# Altium schematic sheet P7_CCD_CAM_BOARD_MYIR.SchDoc
size A3
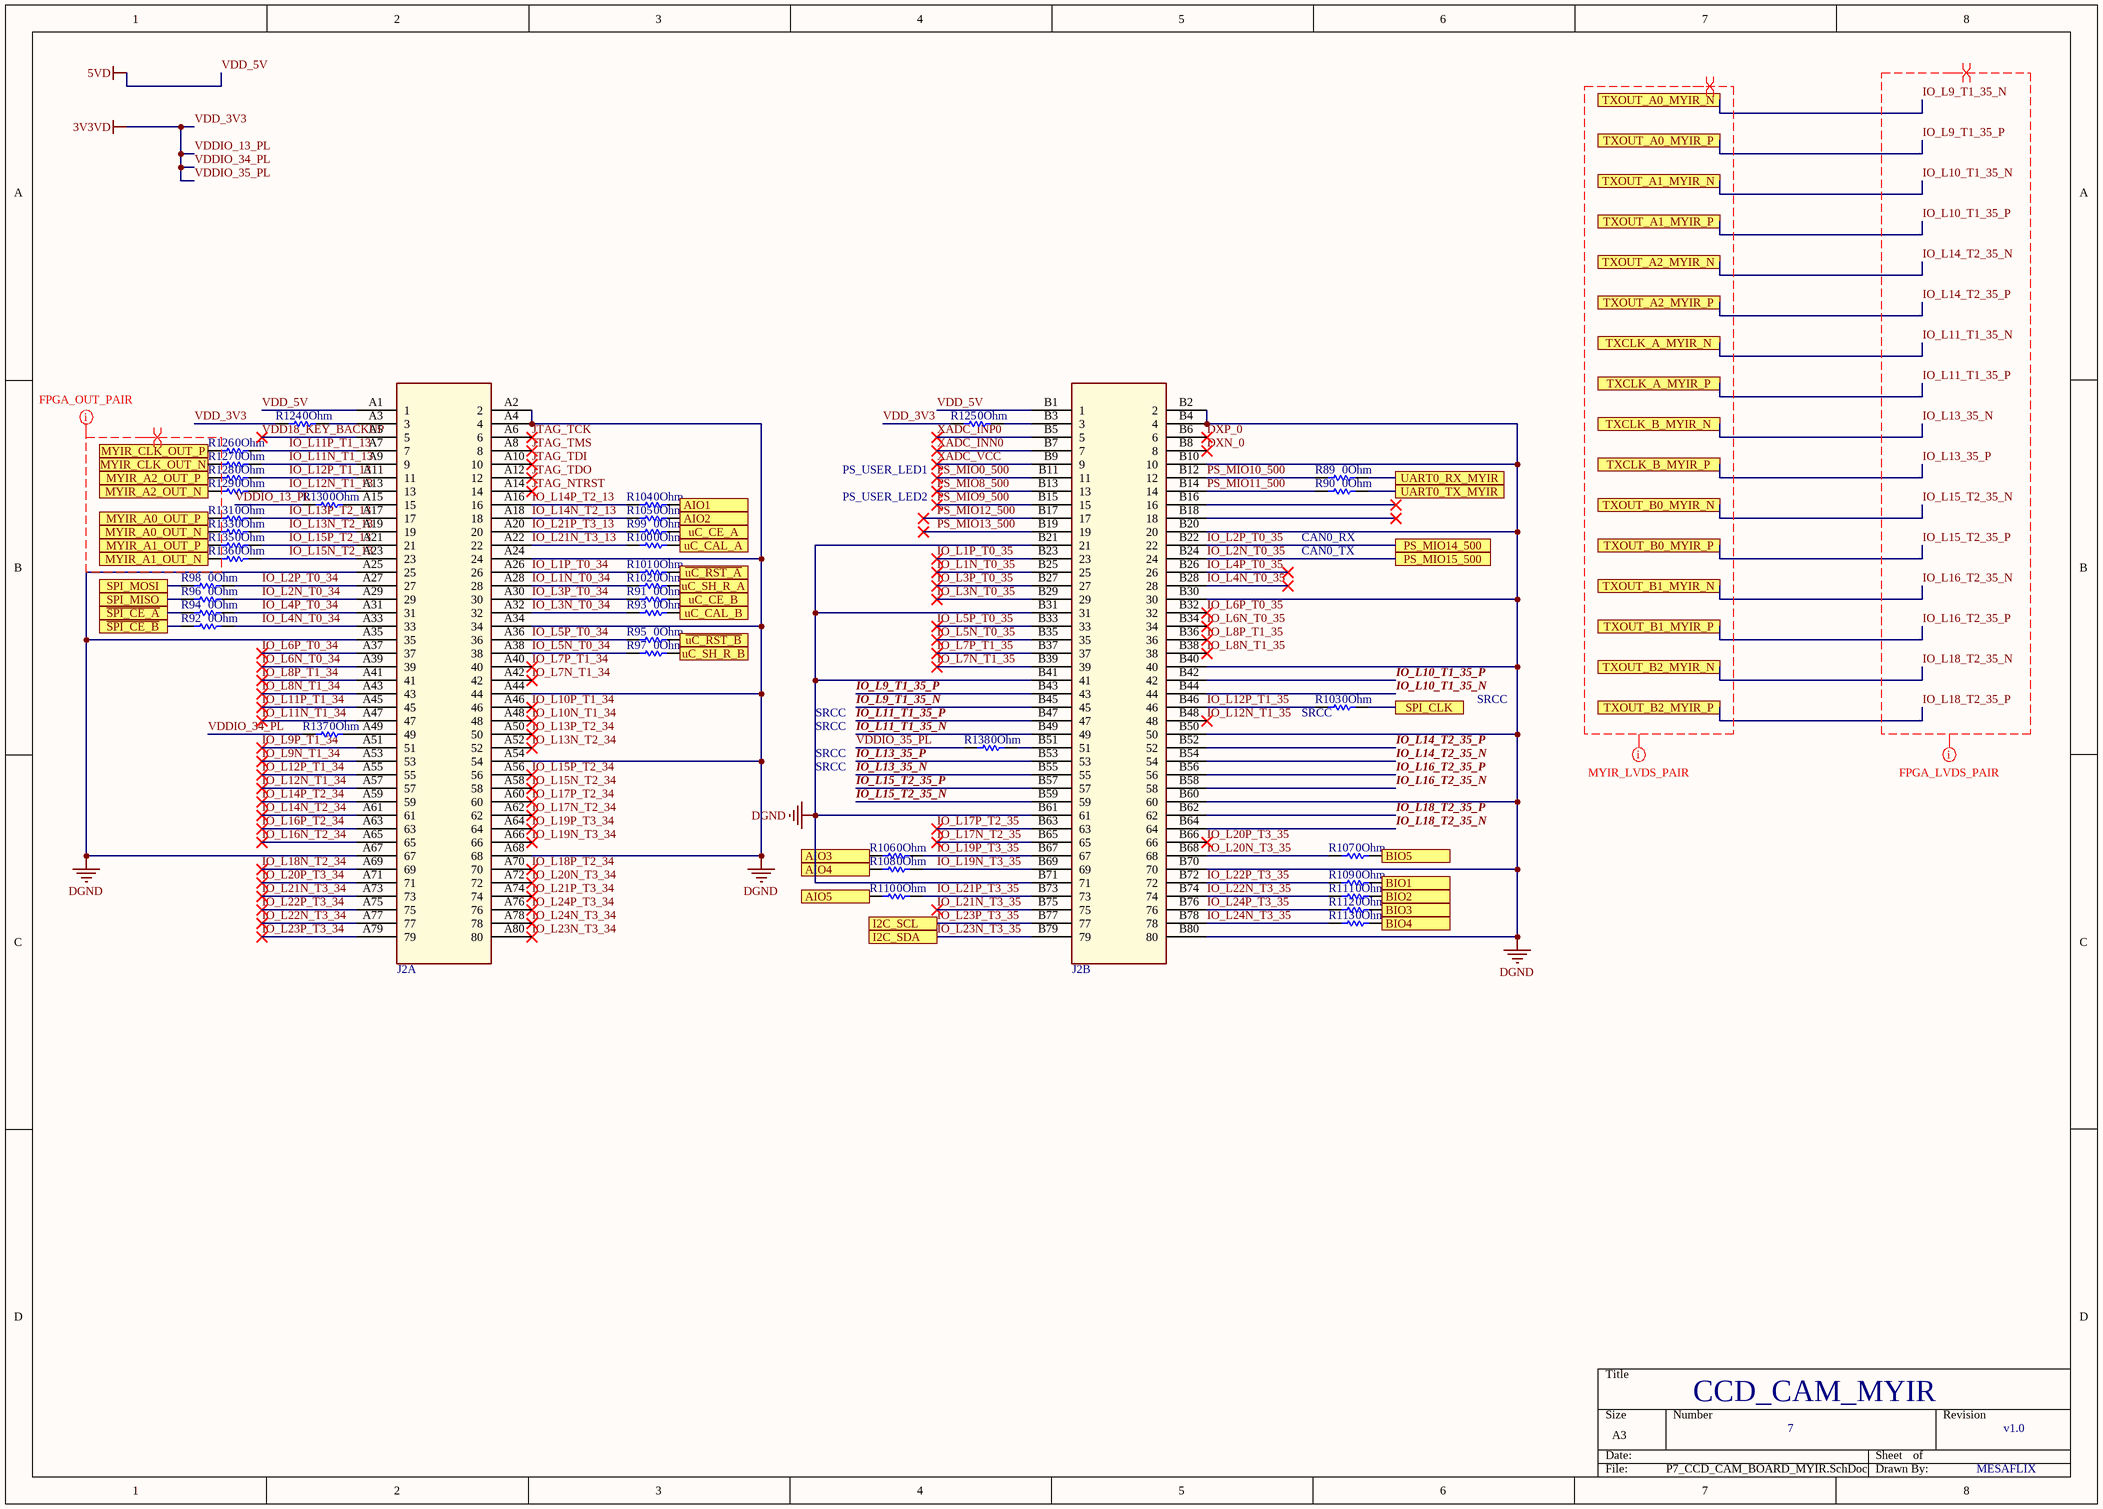
[diagram p0: P7_CCD_CAM_BOARD_MYIR.SchDoc]

## Parts
J2  40x2 Connector 1.27mm Pitch  [CON2x80_MYIR_SMD]  (value not drawn)  (parts A,B of 2)
R89  value 0Ohm  [R 0402(1005)]  (hidden comment: RES_DNP_0603)
R90  value 0Ohm  [R 0402(1005)]  (hidden comment: RES_DNP_0603)
R91  value 0Ohm  [R 0402(1005)]  (hidden comment: RES_DNP_0603)
R92  value 0Ohm  [R 0402(1005)]  (hidden comment: RES_DNP_0603)
R93  value 0Ohm  [R 0402(1005)]  (hidden comment: RES_DNP_0603)
R94  value 0Ohm  [R 0402(1005)]  (hidden comment: RES_DNP_0603)
R95  value 0Ohm  [R 0402(1005)]  (hidden comment: RES_DNP_0603)
R96  value 0Ohm  [R 0402(1005)]  (hidden comment: RES_DNP_0603)
R97  value 0Ohm  [R 0402(1005)]  (hidden comment: RES_DNP_0603)
R98  value 0Ohm  [R 0402(1005)]  (hidden comment: RES_DNP_0603)
R99  value 0Ohm  [R 0402(1005)]  (hidden comment: RES_DNP_0603)
R100  value 0Ohm  [R 0402(1005)]  (hidden comment: RES_DNP_0603)
R101  value 0Ohm  [R 0402(1005)]  (hidden comment: RES_DNP_0603)
R102  value 0Ohm  [R 0402(1005)]  (hidden comment: RES_DNP_0603)
R103  value 0Ohm  [R 0402(1005)]  (hidden comment: RES_DNP_0603)
R104  value 0Ohm  [R 0402(1005)]  (hidden comment: RES_DNP_0603)
R105  value 0Ohm  [R 0402(1005)]  (hidden comment: RES_DNP_0603)
R106  value 0Ohm  [R 0402(1005)]  (hidden comment: RES_DNP_0603)
R107  value 0Ohm  [R 0402(1005)]  (hidden comment: RES_DNP_0603)
R108  value 0Ohm  [R 0402(1005)]  (hidden comment: RES_DNP_0603)
R109  value 0Ohm  [R 0402(1005)]  (hidden comment: RES_DNP_0603)
R110  value 0Ohm  [R 0402(1005)]  (hidden comment: RES_DNP_0603)
R111  value 0Ohm  [R 0402(1005)]  (hidden comment: RES_DNP_0603)
R112  value 0Ohm  [R 0402(1005)]  (hidden comment: RES_DNP_0603)
R113  value 0Ohm  [R 0402(1005)]  (hidden comment: RES_DNP_0603)
R124  value 0Ohm  [R 0402(1005)]  (hidden comment: RES_DNP_0603)
R125  value 0Ohm  [R 0402(1005)]  (hidden comment: RES_DNP_0603)
R126  value 0Ohm  [R 0402(1005)]  (hidden comment: RES_DNP_0603)
R127  value 0Ohm  [R 0402(1005)]  (hidden comment: RES_DNP_0603)
R128  value 0Ohm  [R 0402(1005)]  (hidden comment: RES_DNP_0603)
R129  value 0Ohm  [R 0402(1005)]  (hidden comment: RES_DNP_0603)
R130  value 0Ohm  [R 0402(1005)]  (hidden comment: RES_DNP_0603)
R131  value 0Ohm  [R 0402(1005)]  (hidden comment: RES_DNP_0603)
R133  value 0Ohm  [R 0402(1005)]  (hidden comment: RES_DNP_0603)
R135  value 0Ohm  [R 0402(1005)]  (hidden comment: RES_DNP_0603)
R136  value 0Ohm  [R 0402(1005)]  (hidden comment: RES_DNP_0603)
R137  value 0Ohm  [R 0402(1005)]  (hidden comment: RES_DNP_0603)
R138  value 0Ohm  [R 0402(1005)]  (hidden comment: RES_DNP_0603)

## Ports
AIO1, AIO2, AIO3, AIO4, AIO5, BIO1, BIO2, BIO3, BIO4, BIO5, I2C_SCL, I2C_SDA, MYIR_A0_OUT_N, MYIR_A0_OUT_P, MYIR_A1_OUT_N, MYIR_A1_OUT_P, MYIR_A2_OUT_N, MYIR_A2_OUT_P, MYIR_CLK_OUT_N, MYIR_CLK_OUT_P, PS_MIO14_500, PS_MIO15_500, SPI_CLK, SPI_MISO, SPI_MOSI, TXCLK_A_MYIR_N, TXCLK_A_MYIR_P, TXCLK_B_MYIR_N, TXCLK_B_MYIR_P, TXOUT_A0_MYIR_N, TXOUT_A0_MYIR_P, TXOUT_A1_MYIR_N, TXOUT_A1_MYIR_P, TXOUT_A2_MYIR_N, TXOUT_A2_MYIR_P, TXOUT_B0_MYIR_N, TXOUT_B0_MYIR_P, TXOUT_B1_MYIR_N, TXOUT_B1_MYIR_P, TXOUT_B2_MYIR_N, TXOUT_B2_MYIR_P, UART0_RX_MYIR, UART0_TX_MYIR, uC_CAL_A, uC_CAL_B, uC_CE_A, uC_CE_B, uC_SH_R_A, uC_SH_R_B, ~{SPI_CE_A}, ~{SPI_CE_B}, ~{uC_RST_A}, ~{uC_RST_B}

## Nets
DGND: J2.A2(2) J2.A4(4) J2.A24(24) J2.A25(25) J2.A34(34) J2.A35(35) J2.A44(44) J2.A54(54) J2.A67(67) J2.A68(68) J2.B2(2) J2.B4(4) J2.B10(10) J2.B20(20) J2.B21(21) J2.B30(30) J2.B31(31) J2.B40(40) J2.B41(41) J2.B50(50) J2.B60(60) J2.B61(61) J2.B70(70) J2.B71(71) J2.B80(80)
VDD_3V3: R124.1 R125.1 R130.1 R137.1 R138.1  [also labelled 3V3VD, VDDIO_13_PL, VDDIO_34_PL, VDDIO_35_PL]
VDD_5V: J2.A1(1) J2.B1(1)  [also labelled 5VD]
AIO1: R104.2 ; port AIO1
AIO2: R105.2 ; port AIO2
AIO3: R106.1 ; port AIO3
AIO4: R108.1 ; port AIO4
AIO5: R110.1 ; port AIO5
BIO1: R109.2 ; port BIO1
BIO2: R111.2 ; port BIO2
BIO3: R112.2 ; port BIO3
BIO4: R113.2 ; port BIO4
BIO5: R107.2 ; port BIO5
DXN_0: J2.B8(8)
DXP_0: J2.B6(6)
IO_L1N_T0_34: J2.A28(28) R102.1
IO_L1N_T0_35: J2.B25(25)
IO_L1P_T0_34: J2.A26(26) R101.1
IO_L1P_T0_35: J2.B23(23)
IO_L2N_T0_34: J2.A29(29) R96.2
IO_L2N_T0_35: J2.B24(24) ; port PS_MIO15_500
IO_L2P_T0_34: J2.A27(27) R98.2
IO_L2P_T0_35: J2.B22(22) ; port PS_MIO14_500
IO_L3N_T0_34: J2.A32(32) R93.1
IO_L3N_T0_35: J2.B29(29)
IO_L3P_T0_34: J2.A30(30) R91.1
IO_L3P_T0_35: J2.B27(27)
IO_L4N_T0_34: J2.A33(33) R92.2
IO_L4N_T0_35: J2.B28(28)
IO_L4P_T0_34: J2.A31(31) R94.2
IO_L4P_T0_35: J2.B26(26)
IO_L5N_T0_34: J2.A38(38) R97.1
IO_L5N_T0_35: J2.B35(35)
IO_L5P_T0_34: J2.A36(36) R95.1
IO_L5P_T0_35: J2.B33(33)
IO_L6N_T0_34: J2.A39(39)
IO_L6N_T0_35: J2.B34(34)
IO_L6P_T0_34: J2.A37(37)
IO_L6P_T0_35: J2.B32(32)
IO_L7N_T1_34: J2.A42(42)
IO_L7N_T1_35: J2.B39(39)
IO_L7P_T1_34: J2.A40(40)
IO_L7P_T1_35: J2.B37(37)
IO_L8N_T1_34: J2.A43(43)
IO_L8N_T1_35: J2.B38(38)
IO_L8P_T1_34: J2.A41(41)
IO_L8P_T1_35: J2.B36(36)
IO_L9_T1_35_N: J2.B45(45) ; port TXOUT_A0_MYIR_N
IO_L9_T1_35_P: J2.B43(43) ; port TXOUT_A0_MYIR_P
IO_L9N_T1_34: J2.A53(53)
IO_L9P_T1_34: J2.A51(51)
IO_L10_T1_35_N: J2.B44(44) ; port TXOUT_A1_MYIR_N
IO_L10_T1_35_P: J2.B42(42) ; port TXOUT_A1_MYIR_P
IO_L10N_T1_34: J2.A48(48)
IO_L10P_T1_34: J2.A46(46)
IO_L11_T1_35_N: J2.B49(49) ; port TXCLK_A_MYIR_N
IO_L11_T1_35_P: J2.B47(47) ; port TXCLK_A_MYIR_P
IO_L11N_T1_13: J2.A9(9) R127.2
IO_L11N_T1_34: J2.A47(47)
IO_L11P_T1_13: J2.A7(7) R126.2
IO_L11P_T1_34: J2.A45(45)
IO_L12N_T1_13: J2.A13(13) R129.2
IO_L12N_T1_34: J2.A57(57)
IO_L12N_T1_35: J2.B48(48)
IO_L12P_T1_13: J2.A11(11) R128.2
IO_L12P_T1_34: J2.A55(55)
IO_L12P_T1_35: J2.B46(46) R103.1
IO_L13_35_N: J2.B55(55) ; port TXCLK_B_MYIR_N
IO_L13_35_P: J2.B53(53) ; port TXCLK_B_MYIR_P
IO_L13N_T2_13: J2.A19(19) R133.2
IO_L13N_T2_34: J2.A52(52)
IO_L13P_T2_13: J2.A17(17) R131.2
IO_L13P_T2_34: J2.A50(50)
IO_L14_T2_35_N: J2.B54(54) ; port TXOUT_A2_MYIR_N
IO_L14_T2_35_P: J2.B52(52) ; port TXOUT_A2_MYIR_P
IO_L14N_T2_13: J2.A18(18) R105.1
IO_L14N_T2_34: J2.A61(61)
IO_L14P_T2_13: J2.A16(16) R104.1
IO_L14P_T2_34: J2.A59(59)
IO_L15_T2_35_N: J2.B59(59) ; port TXOUT_B0_MYIR_N
IO_L15_T2_35_P: J2.B57(57) ; port TXOUT_B0_MYIR_P
IO_L15N_T2_13: J2.A23(23) R136.2
IO_L15N_T2_34: J2.A58(58)
IO_L15P_T2_13: J2.A21(21) R135.2
IO_L15P_T2_34: J2.A56(56)
IO_L16_T2_35_N: J2.B58(58) ; port TXOUT_B1_MYIR_N
IO_L16_T2_35_P: J2.B56(56) ; port TXOUT_B1_MYIR_P
IO_L16N_T2_34: J2.A65(65)
IO_L16P_T2_34: J2.A63(63)
IO_L17N_T2_34: J2.A62(62)
IO_L17N_T2_35: J2.B65(65)
IO_L17P_T2_34: J2.A60(60)
IO_L17P_T2_35: J2.B63(63)
IO_L18_T2_35_N: J2.B64(64) ; port TXOUT_B2_MYIR_N
IO_L18_T2_35_P: J2.B62(62) ; port TXOUT_B2_MYIR_P
IO_L18N_T2_34: J2.A69(69)
IO_L18P_T2_34: J2.A70(70)
IO_L19N_T3_34: J2.A66(66)
IO_L19N_T3_35: J2.B69(69) R108.2
IO_L19P_T3_34: J2.A64(64)
IO_L19P_T3_35: J2.B67(67) R106.2
IO_L20N_T3_34: J2.A72(72)
IO_L20N_T3_35: J2.B68(68) R107.1
IO_L20P_T3_34: J2.A71(71)
IO_L20P_T3_35: J2.B66(66)
IO_L21N_T3_13: J2.A22(22) R100.1
IO_L21N_T3_34: J2.A73(73)
IO_L21N_T3_35: J2.B75(75)
IO_L21P_T3_13: J2.A20(20) R99.1
IO_L21P_T3_34: J2.A74(74)
IO_L21P_T3_35: J2.B73(73) R110.2
IO_L22N_T3_34: J2.A77(77)
IO_L22N_T3_35: J2.B74(74) R111.1
IO_L22P_T3_34: J2.A75(75)
IO_L22P_T3_35: J2.B72(72) R109.1
IO_L23N_T3_34: J2.A80(80)
IO_L23N_T3_35: J2.B79(79) ; port I2C_SDA
IO_L23P_T3_34: J2.A79(79)
IO_L23P_T3_35: J2.B77(77) ; port I2C_SCL
IO_L24N_T3_34: J2.A78(78)
IO_L24N_T3_35: J2.B78(78) R113.1
IO_L24P_T3_34: J2.A76(76)
IO_L24P_T3_35: J2.B76(76) R112.1
JTAG_NTRST: J2.A14(14)
JTAG_TCK: J2.A6(6)
JTAG_TDI: J2.A10(10)
JTAG_TDO: J2.A12(12)
JTAG_TMS: J2.A8(8)
MYIR_A0_OUT_N: R133.1 ; port MYIR_A0_OUT_N
MYIR_A0_OUT_P: R131.1 ; port MYIR_A0_OUT_P
MYIR_A1_OUT_N: R136.1 ; port MYIR_A1_OUT_N
MYIR_A1_OUT_P: R135.1 ; port MYIR_A1_OUT_P
MYIR_A2_OUT_N: R129.1 ; port MYIR_A2_OUT_N
MYIR_A2_OUT_P: R128.1 ; port MYIR_A2_OUT_P
MYIR_CLK_OUT_N: R127.1 ; port MYIR_CLK_OUT_N
MYIR_CLK_OUT_P: R126.1 ; port MYIR_CLK_OUT_P
PS_MIO0_500: J2.B11(11)
PS_MIO8_500: J2.B13(13)
PS_MIO9_500: J2.B15(15)
PS_MIO10_500: J2.B12(12) R89.1
PS_MIO11_500: J2.B14(14) R90.1
PS_MIO12_500: J2.B17(17)
PS_MIO13_500: J2.B19(19)
~{SPI_CE_A}: R94.1 ; port ~{SPI_CE_A}
~{SPI_CE_B}: R92.1 ; port ~{SPI_CE_B}
SPI_CLK: R103.2 ; port SPI_CLK
SPI_MISO: R96.1 ; port SPI_MISO
SPI_MOSI: R98.1 ; port SPI_MOSI
~{uC_RST_A}: R101.2 ; port ~{uC_RST_A}
~{uC_RST_B}: R95.2 ; port ~{uC_RST_B}
UART0_RX_MYIR: R89.2 ; port UART0_RX_MYIR
UART0_TX_MYIR: R90.2 ; port UART0_TX_MYIR
uC_CAL_A: R100.2 ; port uC_CAL_A
uC_CAL_B: R93.2 ; port uC_CAL_B
uC_CE_A: R99.2 ; port uC_CE_A
uC_CE_B: R91.2 ; port uC_CE_B
uC_SH_R_A: R102.2 ; port uC_SH_R_A
uC_SH_R_B: R97.2 ; port uC_SH_R_B
VDD18_KEY_BACKUP: J2.A5(5)
XADC_INN0: J2.B7(7)
XADC_INP0: J2.B5(5)
XADC_VCC: J2.B9(9)
NetJ2_A3: J2.A3(3) R124.2
NetJ2_A15: J2.A15(15) R130.2
NetJ2_A49: J2.A49(49) R137.2
NetJ2_B3: J2.B3(3) R125.2
NetJ2_B51: J2.B51(51) R138.2

Not connected (* = marked no-connect by the designer): J2 B16(16)* B18(18)*

## Layout directives
mark named FPGA_LVDS_PAIR: IO_L9_T1_35_N, IO_L9_T1_35_P, IO_L10_T1_35_N, IO_L10_T1_35_P, IO_L11_T1_35_N, IO_L11_T1_35_P, IO_L13_35_N, IO_L13_35_P, IO_L14_T2_35_N, IO_L14_T2_35_P, IO_L15_T2_35_N, IO_L15_T2_35_P, IO_L16_T2_35_N, IO_L16_T2_35_P, IO_L18_T2_35_N, IO_L18_T2_35_P
mark named MYIR_LVDS_PAIR: (no net found under the mark)
mark named FPGA_OUT_PAIR: (no net found under the mark)
differential pair: (no net found under the mark), IO_L9_T1_35_N, IO_L9_T1_35_P, IO_L10_T1_35_N, IO_L10_T1_35_P, IO_L11_T1_35_N, IO_L11_T1_35_P, IO_L13_35_N, IO_L13_35_P, IO_L14_T2_35_N, IO_L14_T2_35_P, IO_L15_T2_35_N, IO_L15_T2_35_P, IO_L16_T2_35_N, IO_L16_T2_35_P, IO_L18_T2_35_N, IO_L18_T2_35_P

## Notes on the sheet
- PS_USER_LED1
- PS_USER_LED2
- CAN0_RX
- CAN0_TX
- SRCC
- (near R103) SRCC
- CCD_CAM_MYIR
- 7
- v1.0
- MESAFLIX

## Library data of the parts
J2 = CON_40x2_MYIR_ZTURN: Manufacturer Part Number: 20021121-00080T4LF; Digikey Part Number: 609-3741-ND
R89-R113 R124-R131 R133 R135-R138 = RES_1K_0603: Manufacturer: Yageo; ManufacturerPartNumber: AC0603FR-070RL; DetailedDesctiprition: 0 Ohms Jumper 0.1W, 1/10W Chip Resistor 0603 (1608 Metric) Automotive AEC-Q200, Moisture Resistant Thick Film; DigikeyPartNumber: 311-0.0LDCT-ND